# EAGLE design comparador (EAGLE 7.6.0)
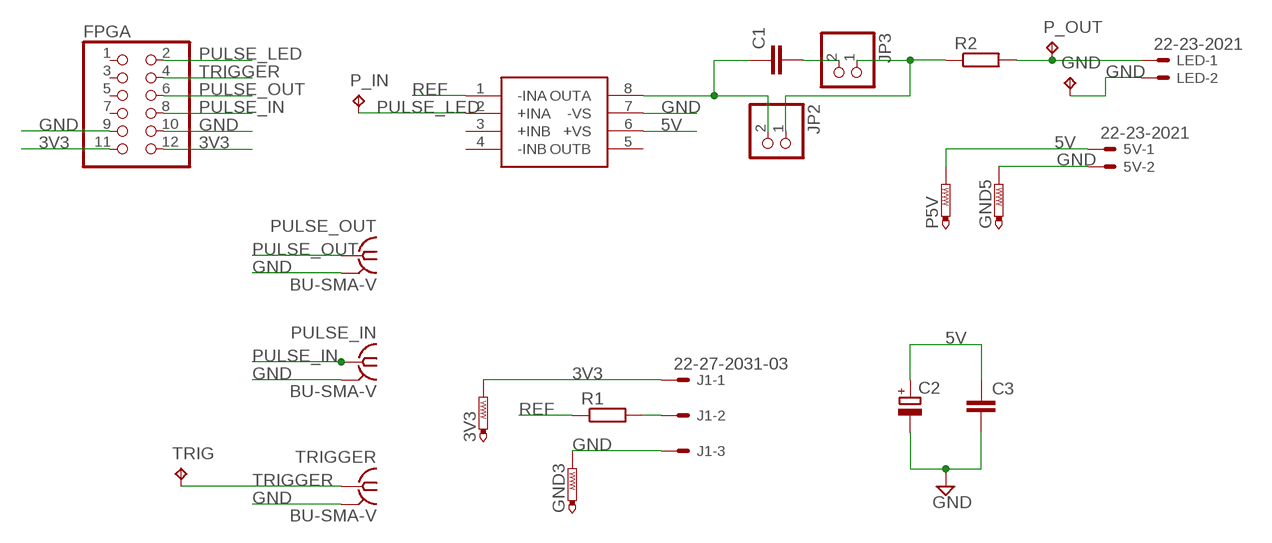
[diagram p0: schematic, sheet 1]

## Parts
3V3  PTR1TP20SQ  [TP20SQ]
5V  22-23-2021  [22-23-2021]
C1  C-EU025-024X044  [C025-024X044]
C2  CPOL-EUE5-8.5  [E5-8,5]
C3  C-EU025-024X044  [C025-024X044]
FPGA  PINHD-2X6  [2X06]
GND  TPPAD1-20  [P1-20]
GND3  PTR1TP20SQ  [TP20SQ]
GND5  PTR1TP20SQ  [TP20SQ]
J1  22-27-2031-03  [6410-03]
JP2  PINHD-1X2  [1X02]
JP3  PINHD-1X2  [1X02]
LED  22-23-2021  [22-23-2021]
OPA  OPA2695  [SOIC127P600X175-8N]
P5V  PTR1TP20SQ  [TP20SQ]
P_IN  TPPAD1-20  [P1-20]
P_OUT  TPPAD1-20  [P1-20]
PULSE_IN  BU-SMA-V  [BU-SMA-V]
PULSE_OUT  BU-SMA-V  [BU-SMA-V]
R1  R-EU_0207/7  [0207/7]
R2  R-EU_0207/7  [0207/7]
TRIG  TPPAD1-20  [P1-20]
TRIGGER  BU-SMA-V  [BU-SMA-V]

## Nets
3V3: 3V3.TP FPGA.11 FPGA.12 J1.1
5V: 5V.1 C2.+ C3.1 OPA.6(+VS) P5V.TP
GND: 5V.2 C2.- C3.2 FPGA.9 FPGA.10 GND3.TP GND5.TP GND.TP J1.3 LED.2 OPA.7(-VS) PULSE_IN.2 PULSE_IN.3 PULSE_IN.4 PULSE_IN.5 PULSE_OUT.2 PULSE_OUT.3 PULSE_OUT.4 PULSE_OUT.5 TRIGGER.2 TRIGGER.3 TRIGGER.4 TRIGGER.5
N$1: LED.1 P_OUT.TP R2.2
N$5: C1.2 JP3.2
N$7: C1.1 JP2.2 OPA.8(OUTA)
N$11: JP2.1 JP3.1 R2.1
N$13: J1.2 R1.2
PULSE_IN: FPGA.8 PULSE_IN.1
PULSE_LED: FPGA.2 OPA.2(+INA) P_IN.TP
PULSE_OUT: FPGA.6 PULSE_OUT.1
REF: OPA.1(-INA) R1.1
TRIGGER: FPGA.4 TRIG.TP TRIGGER.1
Unconnected: FPGA.1 FPGA.3 FPGA.5 FPGA.7 OPA.3(+INB) OPA.4(-INB) OPA.5(OUTB)

## Library data of the parts
3V3 GND3 GND5 P5V = testpad:PTR1: TEST PIN
5V LED = con-molex:22-23-2021: .100" (2.54mm) Center Header - 2 Pin; MF: MOLEX; MPN: 22-23-2021; OC_FARNELL: 1462926; OC_NEWARK: 25C3832
C1 C3 = resistor:C-EU: CAPACITOR, European symbol
C2 = resistor:CPOL-EU: POLARIZED CAPACITOR, European symbol
FPGA = pinhead:PINHD-2X6: PIN HEADER
GND P_IN P_OUT TRIG = testpad:TP: Test pad
J1 = con-molex:22-?-03: CONNECTOR wire to board 2.54 mm (.1 inch) pitch header; OC_FARNELL: unknown; OC_NEWARK: unknown
JP2 JP3 = pinhead:PINHD-1X2: PIN HEADER
OPA = opa2695:OPA2695
PULSE_IN PULSE_OUT TRIGGER = con-coax:BU-SMA-V: FEMALE SMA CONNECTOR Radiall distributor RS 112-3794; OC_FARNELL: unknown; OC_NEWARK: unknown
R1 R2 = rcl:R-EU_: RESISTOR, European symbol

## Board
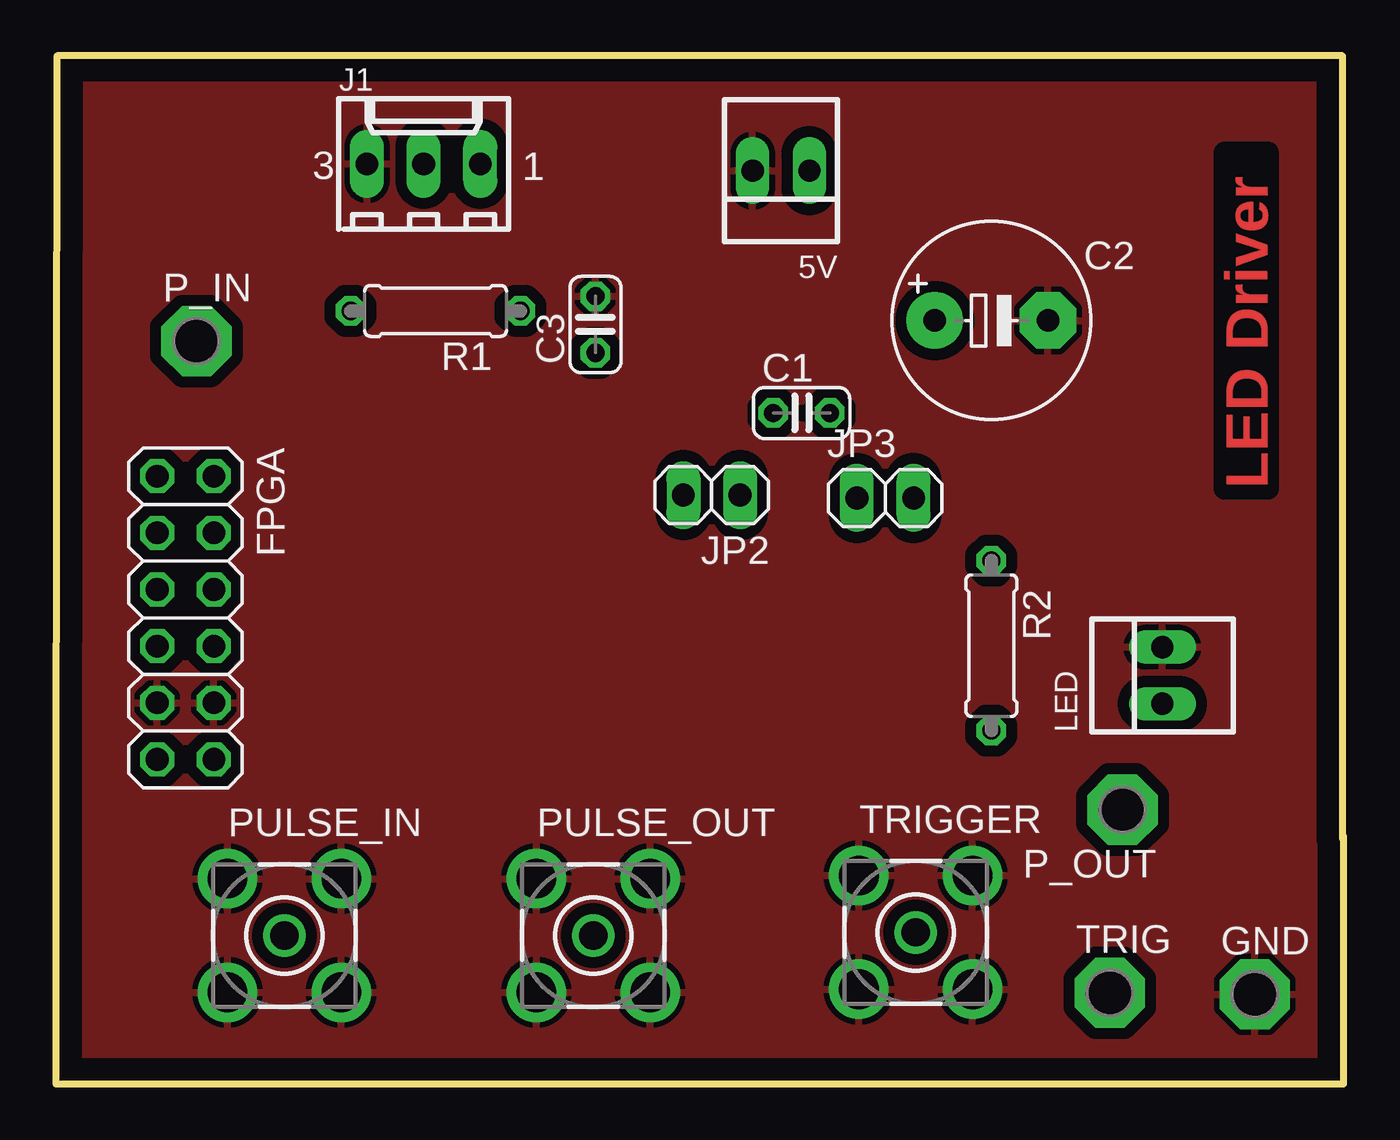
[diagram p1: board, top side]
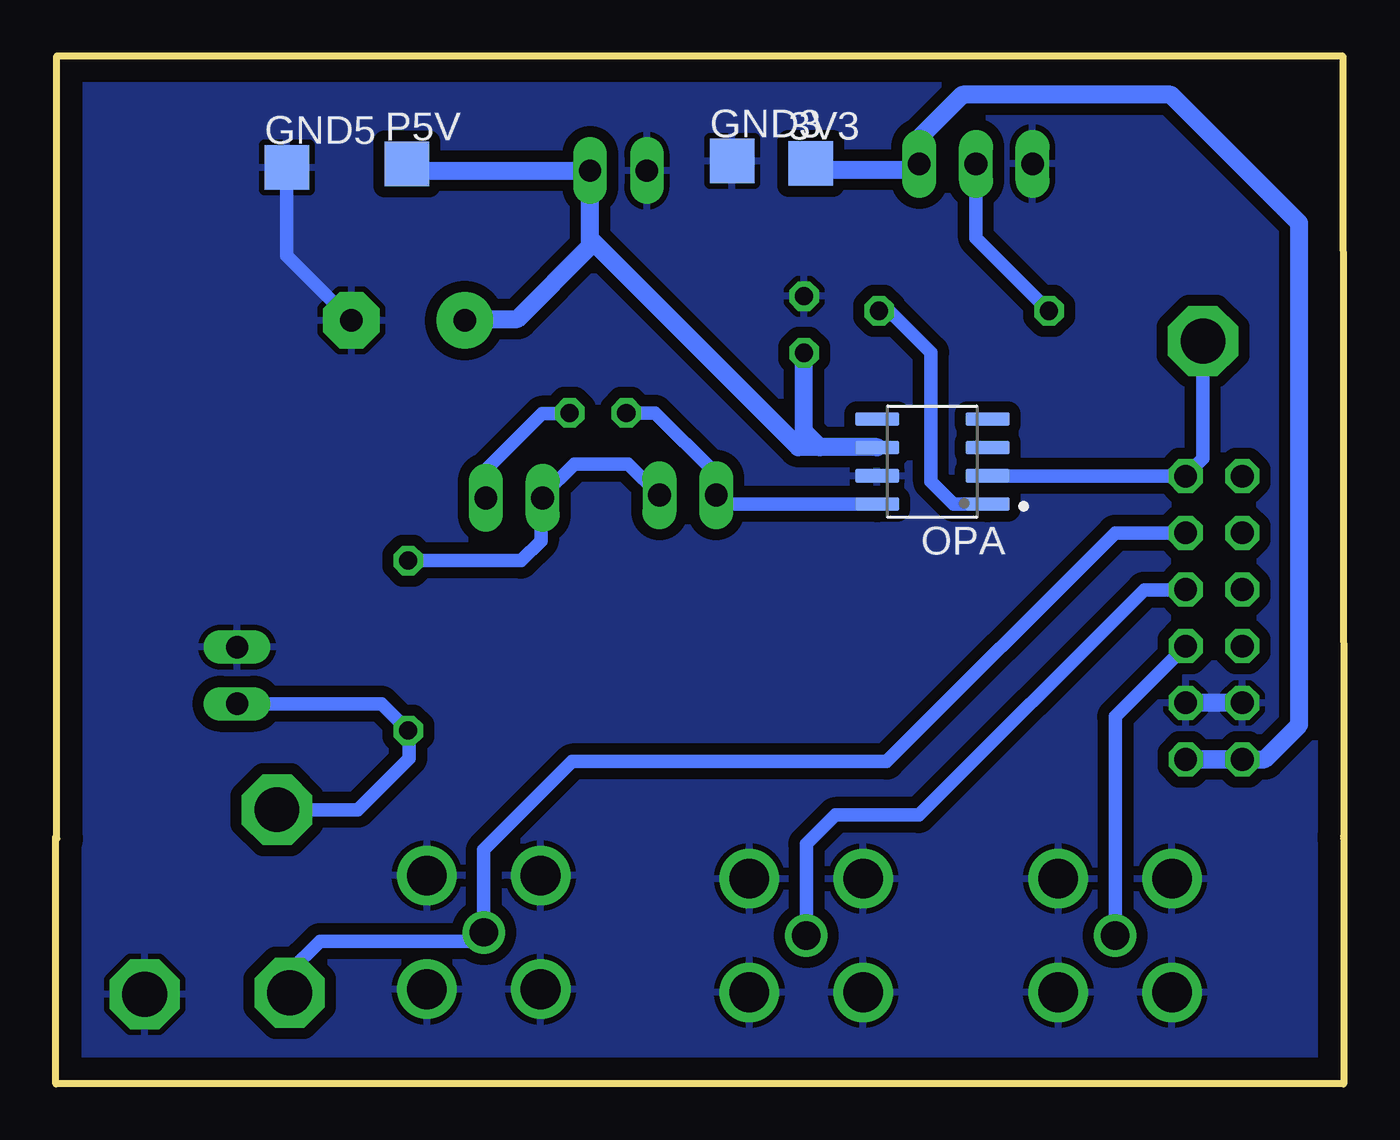
[diagram p2: board, bottom side, seen from below]

Size 57.75 x 46.1 mm. Coordinates in mm from the lower left corner, seen from the top.
Outline: 57.64,41.28 arc90 57.66,41.3
Outline: 57.66,41.3 arc90 57.64,41.33
Outline: 0.04,41.33 arc90 0.01,41.3
Outline: 0.01,41.3 arc90 0.04,41.28
Outline: 57.64,11.02 57.64,41.3 57.62,41.3 arc-180 57.66,41.3
Outline: 57.64,11.02 57.64,11
Outline: 57.62,11 arc90 57.64,10.97
Outline: 57.64,10.97 arc90 57.66,11
Outline: 0.04,11.02 arc90 0.01,11
Outline: 0.01,11 arc90 0.04,10.97
Outline: 57.64,10.97 arc180 57.64,11.02
Outline: 0.01,41.3 arc-180 0.07,41.3 0.04,41.3 0.04,11 0.07,11 arc-180 0.01,11
Outline: 57.7,11 57.7,46.1 0.05,46.1 0,11
Outline: 0,11.1 0,0 57.75,0 57.75,11.1
Copper layers (1*16): Top 0.035mm / dielectric 1.5mm / Bottom 0.035mm
Design rules "default *": minimum track width 10mil, minimum drill 24mil, track to track 0.5mm, track to pad 0.5mm, pad to pad 8mil, via to via 8mil, smd to smd 0.5mm, copper to edge 40mil, drill to drill 8mil, minimum pad ring 10mil, minimum via ring 8mil, stop-mask expansion 4mil, vias tented up to drill 0mil, thermal gap 10mil

### Footprints (pad centres in the part's own frame; a part is rotated, then mirrored left to right if it is on the bottom)
TP20SQ = smd 2 x 2: TP 0,0
22-23-2021 = drill 1 long: 1 -1.27,0; 2 1.27,0
C025-024X044 = drill 0.813 octagon: 1 -1.27,0; 2 1.27,0
E5-8,5 = drill 1.016 pad 2.54: + -2.54,0 | drill 1.016 pad 2.54 octagon: - 2.54,0
2X06 = drill 1.016 octagon: 1 -6.35,-1.27; 2 -6.35,1.27; 3 -3.81,-1.27; 4 -3.81,1.27; 5 -1.27,-1.27; 6 -1.27,1.27; 7 1.27,-1.27; 8 1.27,1.27; 9 3.81,-1.27; 10 3.81,1.27; 11 6.35,-1.27; 12 6.35,1.27
P1-20 = drill 2.007 pad 3.15 octagon: TP 0,0
6410-03 = drill 1.016 long: 1 2.54,0; 2 0,0; 3 -2.54,0
1X02 = drill 1.016 long: 1 -1.27,0; 2 1.27,0
SOIC127P600X175-8N = smd 1.97 x 0.6: 1 -2.475,1.905; 2 -2.475,0.635; 3 -2.475,-0.635; 4 -2.475,-1.905; 5 2.475,-1.905; 6 2.475,-0.635; 7 2.475,0.635; 8 2.475,1.905
BU-SMA-V = drill 1.27: 1 0,0 | drill 1.778: 2 -2.55,2.55; 3 2.55,2.55; 4 2.55,-2.55; 5 -2.55,-2.55
0207/7 = drill 0.813 octagon: 1 -3.81,0; 2 3.81,0

### Placement (x,y rotation side)
3V3  23.9,41.28 0 bottom
5V  32.52,40.95 180 top
C1  33.44,30.08 0 top
C2  41.95,34.23 0 top
C3  24.2,34.05 90 top
FPGA  5.82,20.9 270 top
GND  53.76,4.01 0 top
GND3  27.42,41.38 0 bottom
GND5  47.39,41.09 0 bottom
J1  16.49,41.25 0 top
JP2  29.41,26.4 180 top
JP3  37.19,26.27 0 top
LED  49.62,18.31 90 top
OPA  18.45,27.9 180 bottom
P5V  42,41.25 0 bottom
P_IN  6.31,33.3 0 top
P_OUT  47.83,12.29 180 top
PULSE_IN  10.25,6.65 0 top
PULSE_OUT  24.1,6.65 0 top
R1  17.03,34.66 180 top
R2  41.95,19.65 270 top
TRIG  47.26,4.08 0 top
TRIGGER  38.56,6.79 0 top

### Tracks (layer width: path | path; a pad name or v marks a point on that pad's centre or on a via)
3V3
  Bottom 0.813: FPGA.11 FPGA.12 3.55,14.55 2,16.1 2,38.6 7.75,44.35 17.1,44.35 19.03,42.42 J1.1 19.35,41.25 19.6,41 23.62,41 3V3.TP
5V
  Bottom 0.813: OPA.6 23.5,28.55 | 23.5,28.55 24.45,28.55 33.79,37.89 | 33.79,37.89 5V.1 41.7,40.95 | P5V.TP 41.7,40.95 | 41.7,40.95 41.67,40.92 | 23.5,28.55 24.2,29.25 C3.1 | C2.+ 39.34,34.3 37.05,34.3 33.79,37.56 33.79,37.89
GND
  Bottom 0.61: C2.- 47.39,37.13 GND5.TP
  Bottom 0.813: FPGA.9 FPGA.10
  pour Top: 0.25,0.2 0.3,45.9 57.5,45.9 57.55,0.2
  pour Bottom: 0.3,0.1 0.35,45.8 57.55,45.8 57.6,0.1
N$1
  Bottom 0.61: LED.1 43.15,17.04 R2.2 41.9,15.79 41.9,14.6 44.21,12.29 P_OUT.TP
N$5
  Bottom 0.61: C1.2 34.74,30.05 35.95,30.05 38.46,27.54 JP3.2
N$7
  Bottom 0.61: C1.1 30.88,30.08 28.2,27.4 28.2,26.46 JP2.2 28.14,26.34 27.8,26 OPA.8
N$11
  Bottom 0.61: JP2.1 32.08,27.8 34.5,27.8 35.92,26.38 JP3.1 36,26.19 36,24.35 36.89,23.46 R2.1
N$13
  Bottom 0.61: R1.2 16.49,37.93 J1.2
PULSE_IN
  Bottom 0.61: FPGA.8 10.25,16.47 PULSE_IN.1
PULSE_LED
  Bottom 0.61: OPA.2 7.11,27.27 FPGA.2 6.31,28.03 P_IN.TP
PULSE_OUT
  Bottom 0.61: FPGA.6 7.11,22.15 8.95,22.15 19.05,12.05 22.8,12.05 24.1,10.75 PULSE_OUT.1
REF
  Bottom 0.61: OPA.1 17.5,26 18.5,27 18.5,32.8 20.36,34.66 R1.1
TRIGGER
  Bottom 0.61: FPGA.4 10.25,24.7 20.5,14.45 34.6,14.45 38.56,10.49 TRIGGER.1 38.95,6.4 45.9,6.4 47.26,5.04 TRIG.TP

### Text on the board
Top: LED Driver